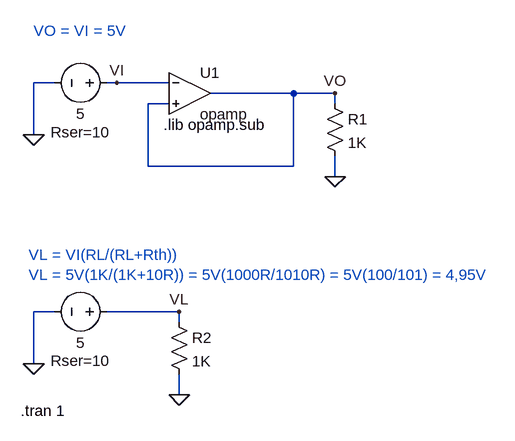
[diagram p0: schematic AMP11 - O Seguidor de Tensão - Buffer.asc]
AMP11 - O Seguidor de Tensão - Buffer.asc, the LTspice schematic file:
Version 4
SHEET 1 880 680
WIRE -16 144 -48 144
WIRE 80 144 64 144
WIRE 160 144 80 144
WIRE 352 160 224 160
WIRE 416 160 352 160
WIRE 160 176 128 176
WIRE 416 176 416 160
WIRE -48 224 -48 144
WIRE 128 272 128 176
WIRE 352 272 352 160
WIRE 352 272 128 272
WIRE 416 288 416 256
WIRE -16 496 -48 496
WIRE 176 496 64 496
WIRE 176 512 176 496
WIRE -48 576 -48 496
WIRE 176 624 176 592
FLAG -48 224 0
FLAG 416 288 0
FLAG 80 144 VI
FLAG 416 160 VO
FLAG -48 576 0
FLAG 176 624 0
FLAG 176 496 VL
SYMBOL Opamps\\opamp 192 96 R0
SYMATTR InstName U1
SYMBOL voltage 80 144 R90
WINDOW 0 -32 56 Invisible 2
WINDOW 3 32 56 VTop 2
WINDOW 123 0 0 Left 2
WINDOW 39 60 56 VTop 2
SYMATTR InstName V1
SYMATTR Value 5
SYMATTR SpiceLine Rser=10
SYMBOL res 400 160 R0
SYMATTR InstName R1
SYMATTR Value 1K
SYMBOL voltage 80 496 R90
WINDOW 0 -32 56 Invisible 2
WINDOW 3 32 56 VTop 2
WINDOW 123 0 0 Left 2
WINDOW 39 60 56 VTop 2
SYMATTR InstName V2
SYMATTR Value 5
SYMATTR SpiceLine Rser=10
SYMBOL res 160 496 R0
SYMATTR InstName R2
SYMATTR Value 1K
TEXT 152 208 Left 2 !.lib opamp.sub
TEXT -68 648 Left 2 !.tran 1
TEXT -48 64 Left 2 ;VO = VI = 5V
TEXT -56 408 Left 2 ;VL = VI(RL/(RL+Rth))\nVL = 5V(1K/(1K+10R)) = 5V(1000R/1010R) = 5V(100/101) = 4,95V

The netlist it stands for:
* AMP11 - O Seguidor de Tensão - Buffer.asc
XU1 VI VO VO opamp Aol=100K GBW=10Meg  ; pins invin noninvin out
V1 VI 0 5 Rser=10
R1 VO 0 1K
V2 VL 0 5 Rser=10
R2 VL 0 1K
.lib opamp.sub
.tran 1
* VO = VI = 5V
* VL = VI(RL/(RL+Rth))
* VL = 5V(1K/(1K+10R)) = 5V(1000R/1010R) = 5V(100/101) = 4,95V
.backanno
.end